# Altium project 2m_DBoard_RX.PrjPcb (part 1 of 2)
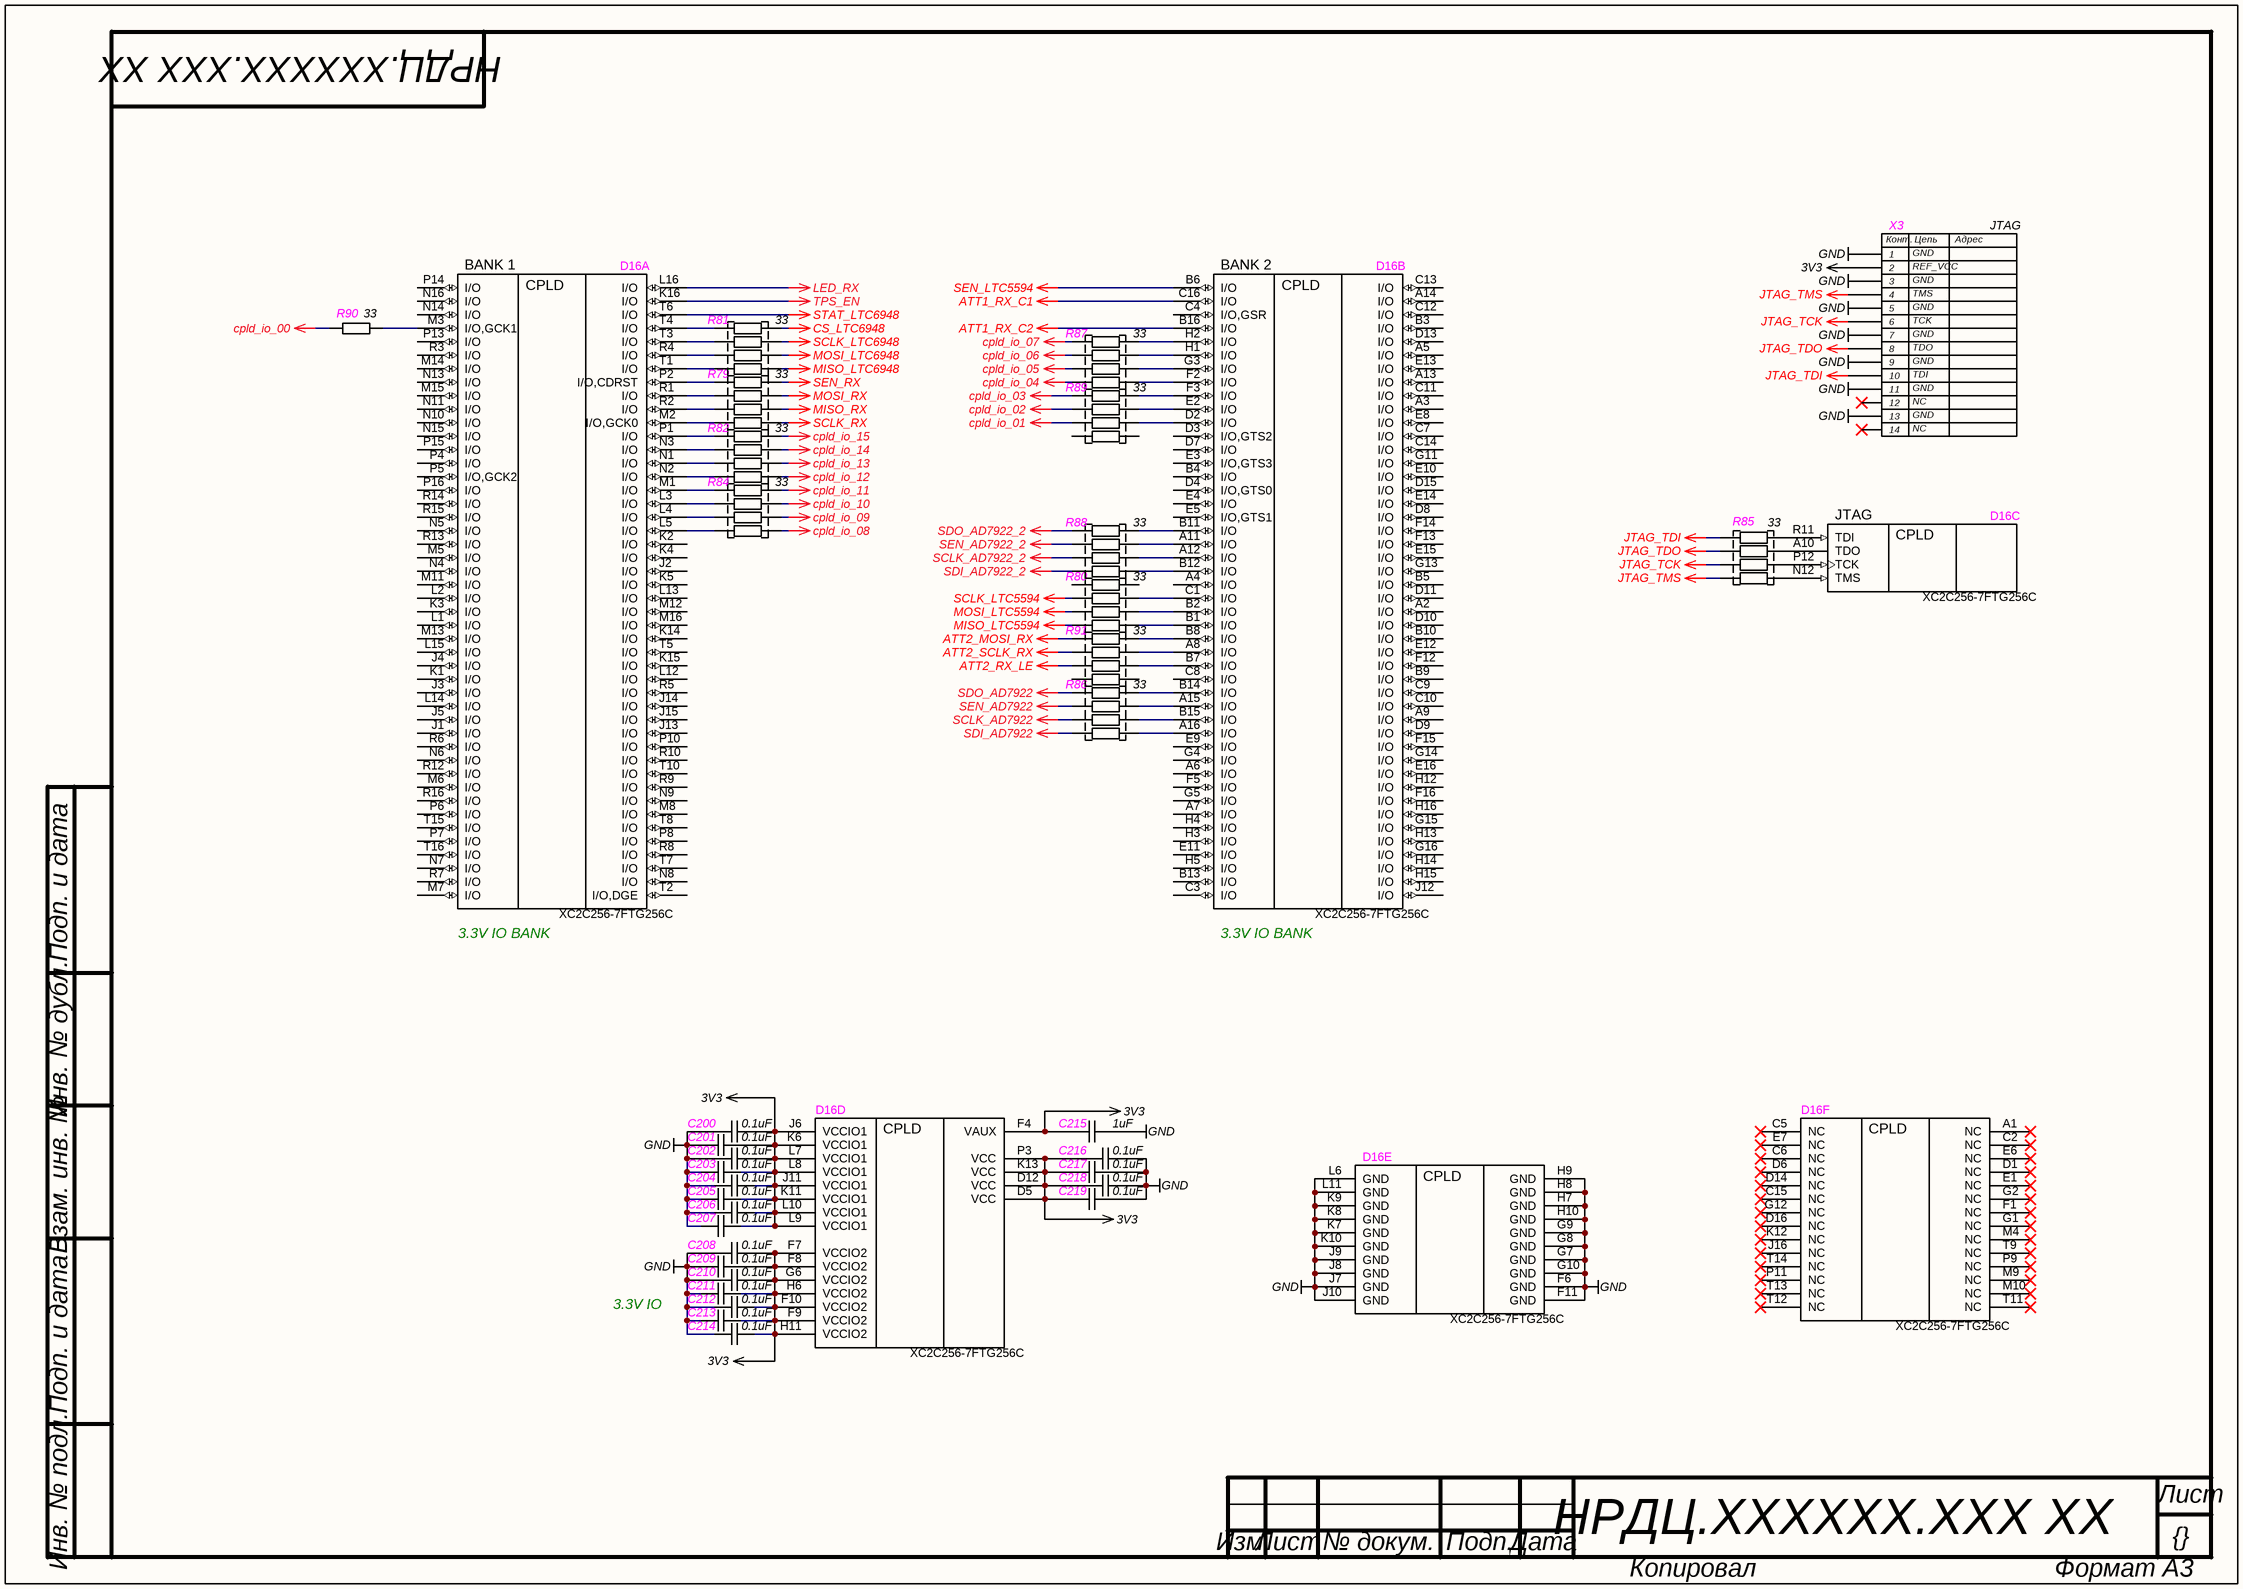
[diagram p0: CPLD.SchDoc]
5 sheets, 234 parts. Net scope: global (net labels, ports and power ports of the same name join across sheets).
Board file: 2m_DBoard_RX.PcbDoc
Sheets:
  CPLD.SchDoc
  RX.SchDoc
  Power.SchDoc
  IF_RX.SchDoc
  DBoard_conn.SchDoc

## Sheet CPLD.SchDoc: {Наименование}
size 420 x 297 mm; DocumentNumber: НРДЦ.ХХХХХХ.ХХХ ХХ; SheetNumber: {}; SheetTotal: {}; PageSetup: Record=PageOptions|CenterHorizontal=False|CenterVertical=False|PrintScale=0.95|XCorrection=0.00|YCorrection=0.00|PrintKind=1|BorderSize=5000000|LeftOffset=0|BottomOffset=0|Orientation=1|PaperLength=1000|PaperWidth=1000|Scale=100|PaperSource=15|PrintQuality=600|MediaType=1|DitherType=10|PaperKind=A4|PrintScaleMode=1; Rule: PcbType=ProtelPcb

### Parts
C200  value 0.1uF  [C0402]  (hidden comment: CAP)
C201  value 0.1uF  [C0402]  (hidden comment: CAP)
C202  value 0.1uF  [C0402]  (hidden comment: CAP)
C203  value 0.1uF  [C0402]  (hidden comment: CAP)
C204  value 0.1uF  [C0402]  (hidden comment: CAP)
C205  value 0.1uF  [C0402]  (hidden comment: CAP)
C206  value 0.1uF  [C0402]  (hidden comment: CAP)
C207  value 0.1uF  [C0402]  (hidden comment: CAP)
C208  value 0.1uF  [C0402]  (hidden comment: CAP)
C209  value 0.1uF  [C0402]  (hidden comment: CAP)
C210  value 0.1uF  [C0402]  (hidden comment: CAP)
C211  value 0.1uF  [C0402]  (hidden comment: CAP)
C212  value 0.1uF  [C0402]  (hidden comment: CAP)
C213  value 0.1uF  [C0402]  (hidden comment: CAP)
C214  value 0.1uF  [C0402]  (hidden comment: CAP)
C215  value 1uF  [C0402]  (hidden comment: CAP)
C216  value 0.1uF  [C0402]  (hidden comment: CAP)
C217  value 0.1uF  [C0402]  (hidden comment: CAP)
C218  value 0.1uF  [C0402]  (hidden comment: CAP)
C219  value 0.1uF  [C0402]  (hidden comment: CAP)
D16  XC2C256-7FTG256C  [FTG256]  (parts A,B,C,D,E,F of 6)
R79  value 33  [EXN8V]  (hidden comment: RES 4x0402)
R80  value 33  [EXN8V]  (hidden comment: RES 4x0402)
R81  value 33  [EXN8V]  (hidden comment: RES 4x0402)
R82  value 33  [EXN8V]  (hidden comment: RES 4x0402)
R84  value 33  [EXN8V]  (hidden comment: RES 4x0402)
R85  value 33  [EXN8V]  (hidden comment: RES 4x0402)
R86  value 33  [EXN8V]  (hidden comment: RES 4x0402)
R87  value 33  [EXN8V]  (hidden comment: RES 4x0402)
R88  value 33  [EXN8V]  (hidden comment: RES 4x0402)
R89  value 33  [EXN8V]  (hidden comment: RES 4x0402)
R90  value 33  [R0402]  (hidden comment: RES)
R91  value 33  [EXN8V]  (hidden comment: RES 4x0402)
X3  JTAG  [JTAG Mail 2mm]

### Nets
3V3: C200.2 C201.2 C202.2 C203.2 C204.2 C205.2 C206.2 C207.2 C208.2 C209.2 C210.2 C211.2 C212.2 C213.2 C214.2 C215.1 C216.1 C217.1 C218.1 C219.1 D16.D5(VCC) D16.D12(VCC) D16.F4(VAUX) D16.F7(VCCIO2) D16.F8(VCCIO2) D16.F9(VCCIO2) D16.F10(VCCIO2) D16.G6(VCCIO2) D16.H6(VCCIO2) D16.H11(VCCIO2) D16.J6(VCCIO1) D16.J11(VCCIO1) D16.K6(VCCIO1) D16.K11(VCCIO1) D16.K13(VCC) D16.L7(VCCIO1) D16.L8(VCCIO1) D16.L9(VCCIO1) D16.L10(VCCIO1) D16.P3(VCC) X3.2
ATT1_RX_C1: D16.C16(I/O)
ATT1_RX_C2: D16.B16(I/O)
ATT2_MOSI_RX: R91.5
ATT2_RX_LE: R91.7
ATT2_SCLK_RX: R91.6
cpld_io_00: R90.2
cpld_io_01: R89.6
cpld_io_02: R89.7
cpld_io_03: R89.8
cpld_io_04: R87.5
cpld_io_05: R87.6
cpld_io_06: R87.7
cpld_io_07: R87.8
cpld_io_08: R84.5
cpld_io_09: R84.6
cpld_io_10: R84.7
cpld_io_11: R84.8
cpld_io_12: R82.5
cpld_io_13: R82.6
cpld_io_14: R82.7
cpld_io_15: R82.8
CS_LTC6948: R81.8
GND: C200.1 C201.1 C202.1 C203.1 C204.1 C205.1 C206.1 C207.1 C208.1 C209.1 C210.1 C211.1 C212.1 C213.1 C214.1 C215.2 C216.2 C217.2 C218.2 C219.2 D16.F6(GND) D16.F11(GND) D16.G7(GND) D16.G8(GND) D16.G9(GND) D16.G10(GND) D16.H7(GND) D16.H8(GND) D16.H9(GND) D16.H10(GND) D16.J7(GND) D16.J8(GND) D16.J9(GND) D16.J10(GND) D16.K7(GND) D16.K8(GND) D16.K9(GND) D16.K10(GND) D16.L6(GND) D16.L11(GND) X3.1 X3.3 X3.5 X3.7 X3.9 X3.11 X3.13
JTAG_TCK: R85.6 X3.6
JTAG_TDI: R85.8 X3.10
JTAG_TDO: R85.7 X3.8
JTAG_TMS: R85.5 X3.4
LED_RX: D16.L16(I/O)
MISO_LTC5594: R80.5
MISO_LTC6948: R81.5
MISO_RX: R79.7
MOSI_LTC5594: R80.6
MOSI_LTC6948: R81.6
MOSI_RX: R79.6
SCLK_AD7922: R86.2
SCLK_AD7922_2: R88.6
SCLK_LTC5594: R80.7
SCLK_LTC6948: R81.7
SCLK_RX: R79.8
SDI_AD7922: R86.1
SDI_AD7922_2: R88.5
SDO_AD7922: R86.4
SDO_AD7922_2: R88.8
SEN_AD7922: R86.3
SEN_AD7922_2: R88.7
SEN_LTC5594: D16.B6(I/O)
SEN_RX: R79.5
STAT_LTC6948: D16.T6(I/O)
TPS_EN: D16.K16(I/O)
NetD16_A8: D16.A8(I/O) R91.3
NetD16_A10: D16.A10(TDO) R85.2
NetD16_A11: D16.A11(I/O) R88.1
NetD16_A12: D16.A12(I/O) R88.3
NetD16_A15: D16.A15(I/O) R86.6
NetD16_A16: D16.A16(I/O) R86.8
NetD16_B1: D16.B1(I/O) R80.4
NetD16_B2: D16.B2(I/O) R80.3
NetD16_B7: D16.B7(I/O) R91.2
NetD16_B8: D16.B8(I/O) R91.4
NetD16_B11: D16.B11(I/O) R88.2
NetD16_B12: D16.B12(I/O) R88.4
NetD16_B14: D16.B14(I/O) R86.5
NetD16_B15: D16.B15(I/O) R86.7
NetD16_C1: D16.C1(I/O) R80.2
NetD16_D2: D16.D2(I/O) R89.3
NetD16_E2: D16.E2(I/O) R89.2
NetD16_F2: D16.F2(I/O) R87.4
NetD16_F3: D16.F3(I/O) R89.1
NetD16_G3: D16.G3(I/O) R87.3
NetD16_H1: D16.H1(I/O) R87.2
NetD16_H2: D16.H2(I/O) R87.1
NetD16_L3: D16.L3(I/O) R84.2
NetD16_L4: D16.L4(I/O) R84.3
NetD16_L5: D16.L5(I/O) R84.4
NetD16_M1: D16.M1(I/O) R84.1
NetD16_M2: D16.M2(I/O,GCK0) R79.1
NetD16_M3: D16.M3(I/O,GCK1) R90.1
NetD16_N1: D16.N1(I/O) R82.3
NetD16_N2: D16.N2(I/O) R82.4
NetD16_N3: D16.N3(I/O) R82.2
NetD16_N12: D16.N12(TMS) R85.4
NetD16_P1: D16.P1(I/O) R82.1
NetD16_P2: D16.P2(I/O,CDRST) R79.4
NetD16_P12: D16.P12(TCK) R85.3
NetD16_R1: D16.R1(I/O) R79.3
NetD16_R2: D16.R2(I/O) R79.2
NetD16_R4: D16.R4(I/O) R81.2
NetD16_R11: D16.R11(TDI) R85.1
NetD16_T1: D16.T1(I/O) R81.4
NetD16_T3: D16.T3(I/O) R81.3
NetD16_T4: D16.T4(I/O) R81.1

Not connected (* = marked no-connect by the designer): D16 A1(NC)* A2(I/O) A3(I/O) A4(I/O) A5(I/O) A6(I/O) A7(I/O) A9(I/O) A13(I/O) A14(I/O) B3(I/O) B4(I/O) B5(I/O) B9(I/O) B10(I/O) B13(I/O) C2(NC)* C3(I/O) C4(I/O,GSR) C5(NC)* C6(NC)* C7(I/O) C8(I/O) C9(I/O) C10(I/O) C11(I/O) C12(I/O) C13(I/O) C14(I/O) C15(NC)* D1(NC)* D3(I/O,GTS2) D4(I/O,GTS0) D6(NC)* D7(I/O) D8(I/O) D9(I/O) D10(I/O) D11(I/O) D13(I/O) D14(NC)* D15(I/O) D16(NC)* E1(NC)* E3(I/O,GTS3) E4(I/O) E5(I/O,GTS1) E6(NC)* E7(NC)* E8(I/O) E9(I/O) E10(I/O) E11(I/O) E12(I/O) E13(I/O) E14(I/O) E15(I/O) E16(I/O) F1(NC)* F5(I/O) F12(I/O) F13(I/O) F14(I/O) F15(I/O) F16(I/O) G1(NC)* G2(NC)* G4(I/O) G5(I/O) G11(I/O) G12(NC)* G13(I/O) G14(I/O) G15(I/O) G16(I/O) H3(I/O) H4(I/O) H5(I/O) H12(I/O) H13(I/O) H14(I/O) H15(I/O) H16(I/O) J1(I/O) J2(I/O) J3(I/O) J4(I/O) J5(I/O) J12(I/O) J13(I/O) J14(I/O) J15(I/O) J16(NC)* K1(I/O) K2(I/O) K3(I/O) K4(I/O) K5(I/O) K12(NC)* K14(I/O) K15(I/O) L1(I/O) L2(I/O) L12(I/O) L13(I/O) L14(I/O) L15(I/O) M4(NC)* M5(I/O) M6(I/O) M7(I/O) M8(I/O) M9(NC)* M10(NC)* M11(I/O) M12(I/O) M13(I/O) M14(I/O) M15(I/O) M16(I/O) N4(I/O) N5(I/O) N6(I/O) N7(I/O) N8(I/O) N9(I/O) N10(I/O) N11(I/O) N13(I/O) N14(I/O) N15(I/O) N16(I/O) P4(I/O) P5(I/O,GCK2) P6(I/O) P7(I/O) P8(I/O) P9(NC)* P10(I/O) P11(NC)* P13(I/O) P14(I/O) P15(I/O) P16(I/O) R3(I/O) R5(I/O) R6(I/O) R7(I/O) R8(I/O) R9(I/O) R10(I/O) R12(I/O) R13(I/O) R14(I/O) R15(I/O) R16(I/O) T2(I/O,DGE) T5(I/O) T7(I/O) T8(I/O) T9(NC)* T10(I/O) T11(NC)* T12(NC)* T13(NC)* T14(NC)* T15(I/O) T16(I/O); R80 1 8; R89 4 5; R91 1 8; X3 12* 14*

### Notes on the sheet
- (near X3) GND
- (near X3) REF_VCC
- (near X3) TMS
- (near X3) TCK
- (near X3) TDO
- (near X3) TDI
- (near X3) NC
- (near D16) 3.3V IO BANK
- 3.3V IO
- Подп. и дата
- Инв. № дубл.
- Взам. инв. №
- Инв. № подл.
- Лист
- Изм.
- № докум.
- Подп.
- Дата
- Копировал
- Формат А3
- (in symbol HDR Debug_14-pin) Конт.; Цепь; Адрес
- (in symbol XC2C256-7FTG256C, part A) BANK 1
- (in symbol XC2C256-7FTG256C, part B) BANK 2
- (in symbol XC2C256-7FTG256C, part C) JTAG

### Library data of the parts
C200-C214 C216-C219 = CAP: SMD Capacitor; Manufacturer: Murata; Material: X7R; Tolerance: 10%; Voltage: 10V; Type: Ceramic Capacitor; P/N: GRM155R71A104KA01J; Supplier 1: Digi-key; Supplier Part Number 1: 490-6322-1-ND; Supplier 2: Mouser; Supplier Part Number 2: 81-GRM155R71A104KA1J; Supplier 3: Farnell; Supplier Part Number 3: *
C215 = CAP: SMD Capacitor; Manufacturer: Murata; Material: X7R; Tolerance: 10%; Voltage: 6.3V; Type: Ceramic Capacitor; P/N: GRM155R70J105KA12J; Supplier 1: Digi-key; Supplier Part Number 1: 490-13339-1-ND; Supplier 2: Mouser; Supplier Part Number 2: 81-GRM155R70J105KA2J; Supplier 3: Farnell; Supplier Part Number 3: *
D16 = XC2C256-7FTG256C: CoolRunner-II 1.8V, 256 Macrocell CPLD, 184 User I/Os, 256-Ball FTBGA, Commercial Grade, Pb-Free; Code_JEDEC: MS-034-AAF-1*; PackageVersion: ver1.3, Oct-2007; PackageReference: FTG256; PackageDescription: 256-Ball Fine Pitch Thin Ball Grid Array 1.00 mm Pitch (FTG256) - Pb-Free; DatasheetVersion: ver3.2, Mar-2007; PartNumber: XC2C256-7FTG256C; P/N: XC2C256-7FTG256C; Name: XC2C256-7FTG256C; Type: CPLD; Supplier 1: Digi-key; Supplier Part Number 1: 122-1400-ND; Supplier 2: Mouser; Supplier Part Number 2: 217-XC2C256-7FTG256C; Supplier 3: Farnell; Supplier Part Number 3: *
R79-R82 R84-R89 R91 = RES 4x0402: Chip Resistor Array; Manufacturer: Panasonic; Name: EXBN8V; Number of Resistors: 4; Tolerance: 5%; P/N: EXB-N8V330JX; Type: 0402 Array Concave Terminal; Number of Terminals: 8; Series: EXB; Supplier Part Number 1: Y10330CT-ND; Supplier 2: Mouser; Supplier Part Number 2: 667-EXB-N8V330JX; Supplier 3: Farnell; Supplier Part Number 3: *
  R79 R80 R82 R84-R89 R91: Supplier 1: Digi-key
  R81: Supplier 1: Digi-Key
R90 = RES: SMD Resistor; Name: Chip SMD Resistor; Power: 0.1 Wt; Tolerance: 1%; P/N: ERJ-2RKF33R0X; Temperature Range: -55…155°C; Supplier 1: Digi-key; Supplier Part Number 1: P33.0LCT-ND; Supplier 2: Mouser; Supplier Part Number 2: 667-ERJ-2RKF33R0X; Supplier 3: Farnell; Supplier Part Number 3: *
X3 = HDR Debug_14-pin: 2.00mm Pitch, Milli-Grid PCB Header, Dual Row, Vertical, Through Hole, Shrouded, 14 / Circuits; Manufacturer: Molex; Name: Milli-Grid Connector System; P/N: 878311421; Type: 2.00mm Pitch, Milli-Grid PCB Header, Dual Row, Vertical, Through Hole, Shrouded, 14; Series: 87831; Supplier 1: Digi-key; Supplier Part Number 1: WM4224-ND; Supplier 2: Mouser; Supplier Part Number 2: 538-87831-1421; Supplier 3: Farnell; Supplier Part Number 3: *

## Sheet RX.SchDoc: {Наименование}
size 420 x 297 mm; ApprovedBy: {Утвердил}; CheckedBy: {Проверил}; DrawnBy: {Разраб.}; DocumentNumber: НРДЦ.ХХХХХХ.ХХХ 00; SheetNumber: {}; SheetTotal: {}; Scale: {Мш.}; PageSetup: Record=PageOptions|CenterHorizontal=False|CenterVertical=False|PrintScale=0.95|XCorrection=0.00|YCorrection=0.00|PrintKind=1|BorderSize=5000000|LeftOffset=0|BottomOffset=0|Orientation=1|PaperLength=1000|PaperWidth=1000|Scale=100|PaperSource=15|PrintQuality=600|MediaType=1|DitherType=10|PaperKind=A4|PrintScaleMode=1; ProcessInspection: {Т.контр.}; Mass: {М.}; NormInspection: {Н.контр.}; Letter1Column: {}; Letter2Column: {}; Letter3Column: {}; DocumentType: {Документ}; Rule: PcbType=ProtelPcb
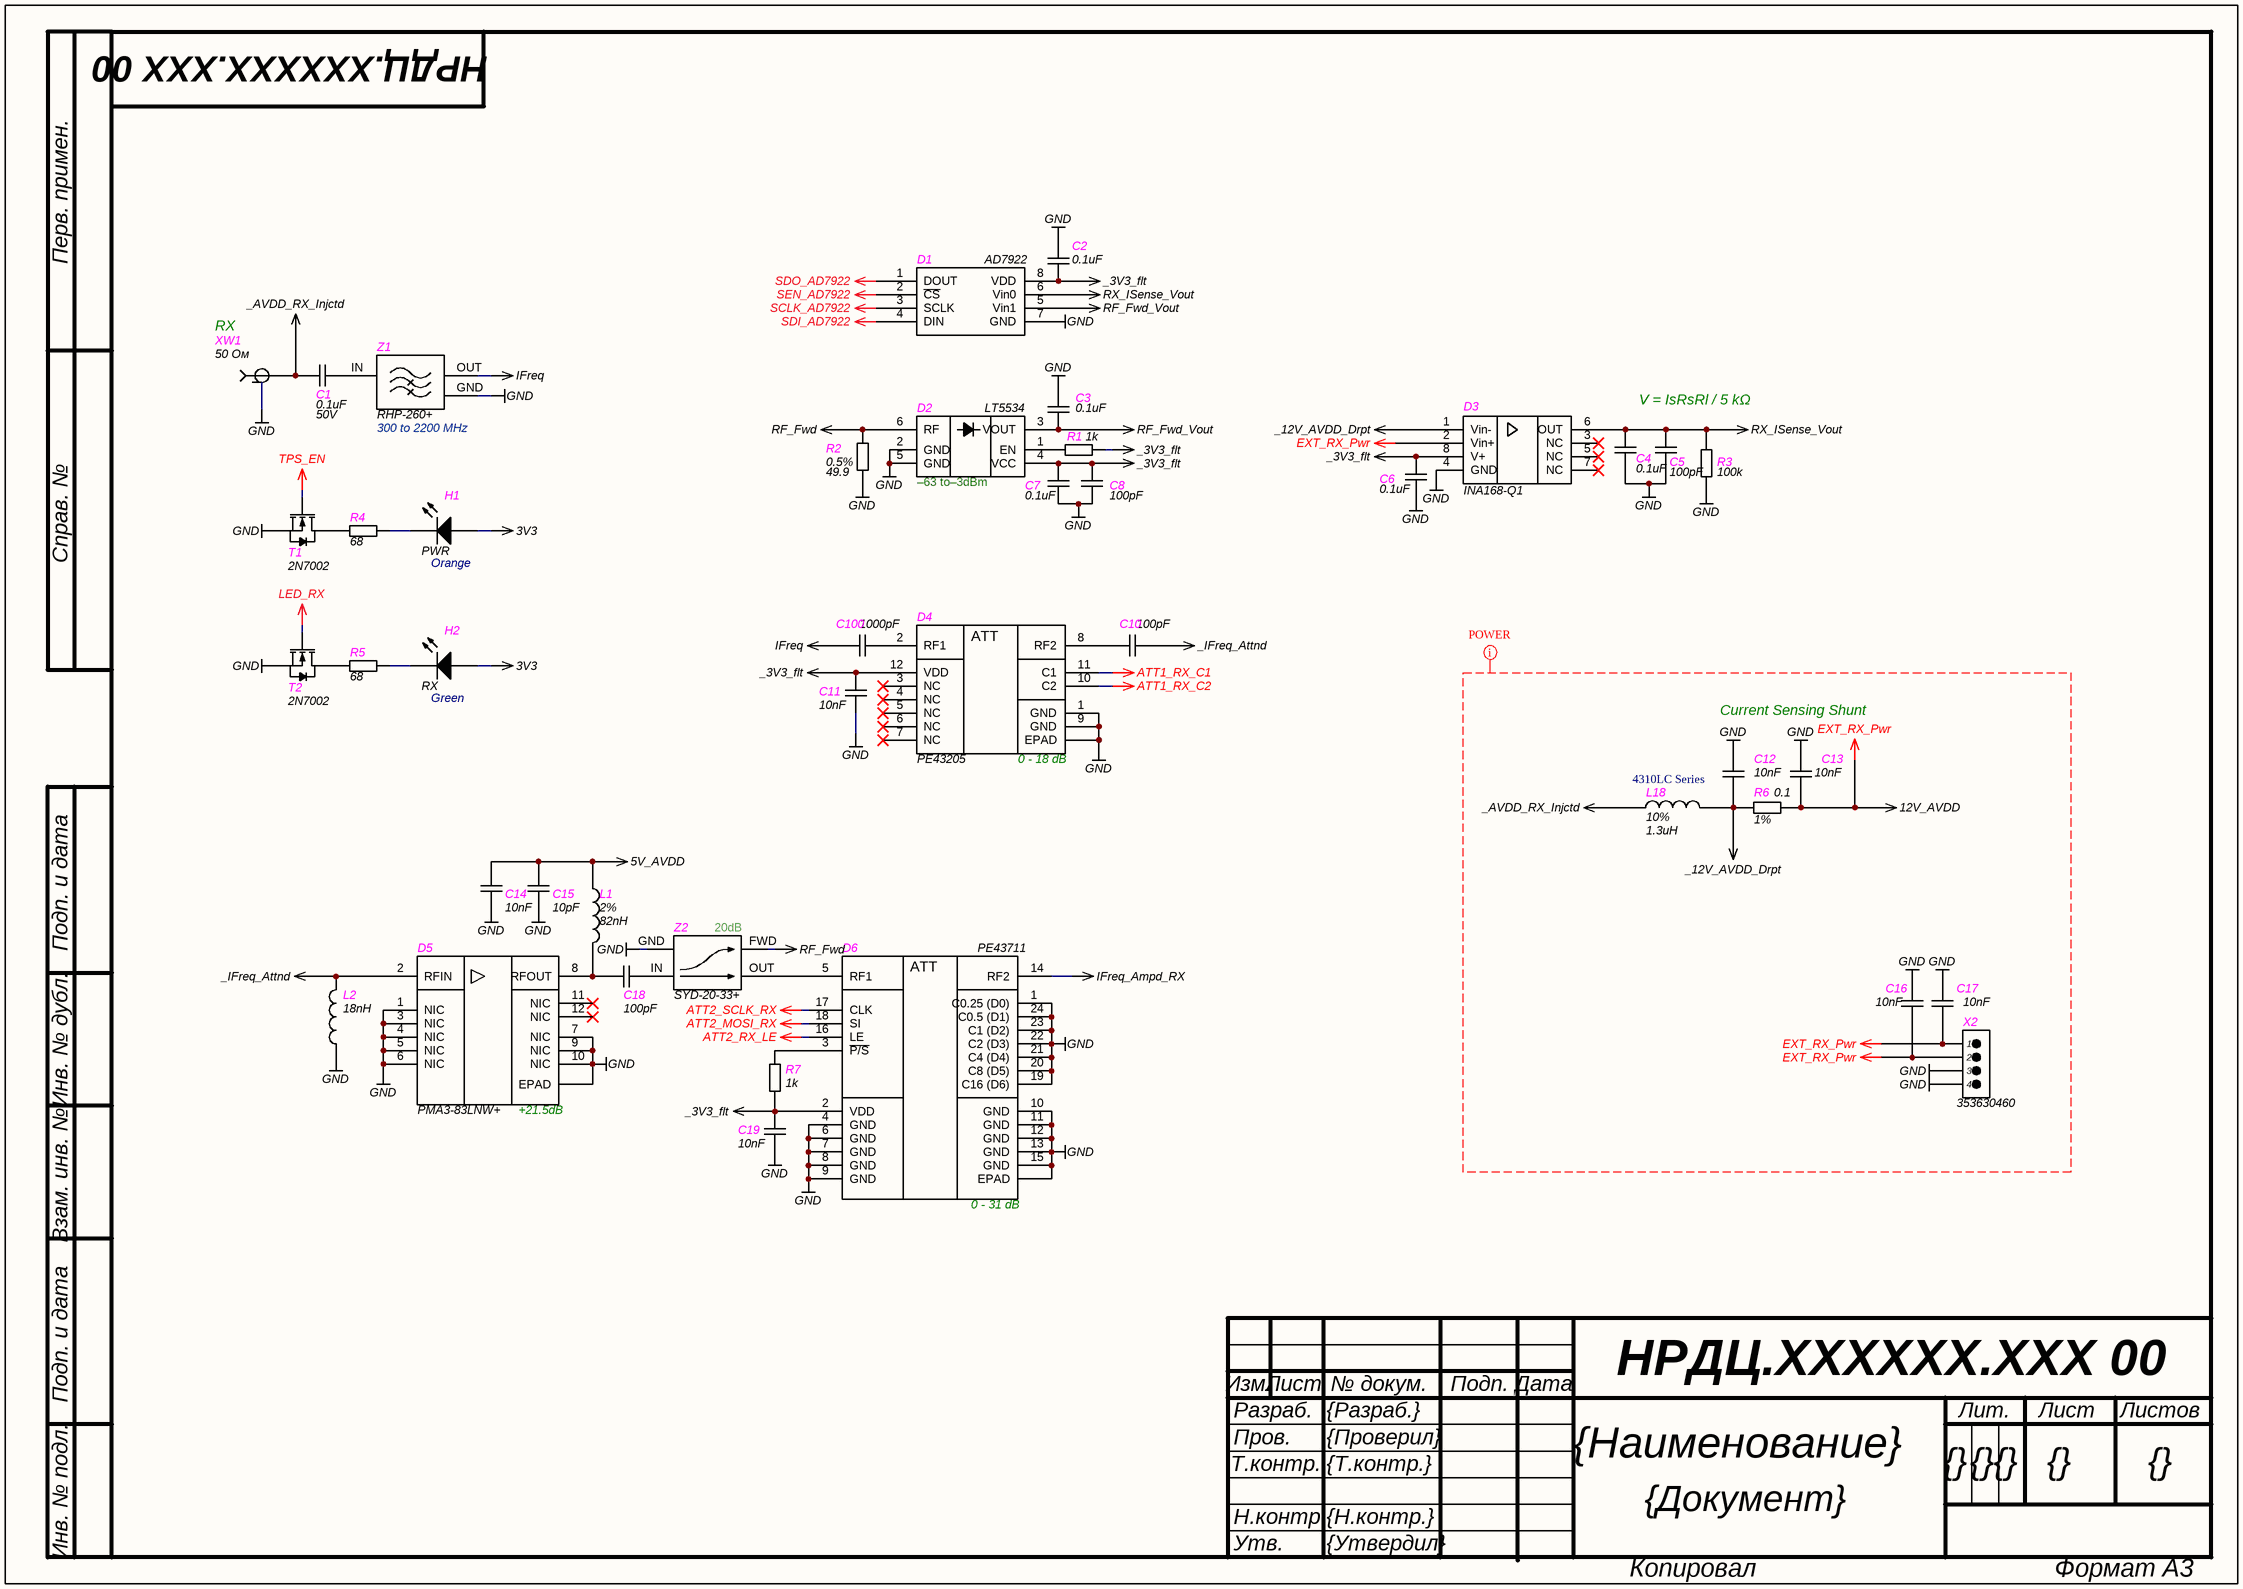
[diagram p1: RX.SchDoc]

### Parts
C1  value 0.1uF  Voltage: 50V  [C1206]  (hidden comment: CAP)
C2  value 0.1uF  [C0402]  (hidden comment: CAP)
C3  value 0.1uF  [C0402]  (hidden comment: CAP)
C4  value 0.1uF  [C0402]  (hidden comment: CAP)
C5  value 100pF  [C0402]  (hidden comment: CAP)
C6  value 0.1uF  [C0402]  (hidden comment: CAP)
C7  value 0.1uF  [C0402]  (hidden comment: CAP)
C8  value 100pF  [C0402]  (hidden comment: CAP)
C10  value 100pF  [C0402]  (hidden comment: CAP)
C11  value 10nF  [C0402]  (hidden comment: CAP)
C12  value 10nF  [C0402]  (hidden comment: CAP)
C13  value 10nF  [C0402]  (hidden comment: CAP)
C14  value 10nF  [C0402]  (hidden comment: CAP)
C15  value 10pF  [C0402]  (hidden comment: CAP)
C16  value 10nF  [C0402]  (hidden comment: CAP)
C17  value 10nF  [C0402]  (hidden comment: CAP)
C18  value 100pF  [C0402]  (hidden comment: CAP)
C19  value 10nF  [C0402]  (hidden comment: CAP)
C100  value 1000pF  [C0402]  (hidden comment: CAP)
D1  AD7922  [MSOP-8]
D2  LT5534  RF Input Power Range: –63 to–3dBm  [SC70]
D3  INA168-Q1  [TSSOP (8)]
D4  PE43205  [QFN-12]
D5  PMA3-83LNW+  [DQ1225]
D6  PE43711  [QFN-24]
H1  PWR  Color: Orange  [LED_0805_Green]
H2  RX  Color: Green  [LED_0805_Green]
L1  value 82nH  Tolerance: 2%  [L0603_HP]  (hidden comment: Inductor RF)
L2  value 18nH  [L0603_HP]  (hidden comment: Inductor RF)
L18  value 1.3uH  Tolerance: 10%  [4310LC]  (hidden comment: Inductor RF)
R1  value 1k  [R0402]  (hidden comment: RES)
R2  value 49.9  Tolerance: 0.5%  [R0402]  (hidden comment: RES)
R3  value 100k  [R0402]  (hidden comment: RES)
R4  value 68  [R0402]  (hidden comment: RES)
R5  value 68  [R0402]  (hidden comment: RES)
R6  value 0.1  Tolerance: 1%  [R0805]  (hidden comment: RES)
R7  value 1k  [R0402]  (hidden comment: RES)
T1  2N7002  [SOT-23]
T2  2N7002  [SOT-23]
X2  353630460  [CON_353630460]
XW1  50 Ом  [MOLEX SD-73251-135 (Gold)]
Z1  RHP-260+  Frequency: 300 to 2200 MHz  [GP731]
Z2  SYD-20-33+  Coupling: 20dB  [AH202]

### Nets
3V3: H1.2(A) H2.2(A)
5V_AVDD: C14.2 C15.2 L1.2
12V_AVDD: C13.1 C16.2 C17.2 D3.2(Vin+) R6.1 X2.1 X2.2  [also labelled EXT_RX_Pwr]
_3V3_flt: C2.1 C6.2 C7.2 C8.2 C11.2 C19.2 D1.8(VDD) D2.4(VCC) D3.8(V+) D4.12(VDD) D6.2(VDD) R1.1 R7.1
_12V_AVDD_Drpt: C12.1 D3.1(Vin-) L18.1 R6.2
_AVDD_RX_Injctd: C1.1 L18.2 XW1.S(RF)
_IFreq_Attnd: C10.2 D5.2(RFIN) L2.2
ATT1_RX_C1: D4.11(C1)
ATT1_RX_C2: D4.10(C2)
ATT2_MOSI_RX: D6.18(SI)
ATT2_RX_LE: D6.16(LE)
ATT2_SCLK_RX: D6.17(CLK)
GND: C2.2 C3.1 C4.1 C5.1 C6.1 C7.1 C8.1 C11.1 C12.2 C13.2 C14.1 C15.1 C16.1 C17.1 C19.1 D1.7(GND) D2.2(GND) D2.5(GND) D3.4(GND) D4.1(GND) D4.9(GND) D4.13(EPAD) D5.1(NIC) D5.3(NIC) D5.4(NIC) D5.5(NIC) D5.6(NIC) D5.7(NIC) D5.9(NIC) D5.10(NIC) D5.13(EPAD) D6.1(C0.25_(D0)) D6.4(GND) D6.6(GND) D6.7(GND) D6.8(GND) D6.9(GND) D6.10(GND) D6.11(GND) D6.12(GND) D6.13(GND) D6.15(GND) D6.19(C16_(D6)) D6.20(C8_(D5)) D6.21(C4_(D4)) D6.22(C2_(D3)) D6.23(C1_(D2)) D6.24(C0.5_(D1)) D6.25(EPAD) L2.1 R2.2 R3.1 T1.2(S) T2.2(S) X2.3 X2.4 XW1.G(GND) Z1.GND Z2.GND
IFreq: C100.1 Z1.OUT
IFreq_Ampd_RX: D6.14(RF2)
LED_RX: T2.1(G)
RF_Fwd: D2.6(RF) R2.1 Z2.FWD
RF_Fwd_Vout: C3.2 D1.5(Vin1) D2.3(VOUT)
RX_ISense_Vout: C4.2 C5.2 D1.6(Vin0) D3.6(OUT) R3.2
SCLK_AD7922: D1.3(SCLK)
SDI_AD7922: D1.4(DIN)
SDO_AD7922: D1.1(DOUT)
SEN_AD7922: D1.2(~{CS})
TPS_EN: T1.1(G)
NetC1_2: C1.2 Z1.IN
NetC10_1: C10.1 D4.8(RF2)
NetC18_1: C18.1 D5.8(RFOUT) L1.1
NetC18_2: C18.2 Z2.IN
NetC100_2: C100.2 D4.2(RF1)
NetD2_1: D2.1(EN) R1.2
NetD6_3: D6.3(~{P/S}) R7.2
NetD6_5: D6.5(RF1) Z2.OUT
NetH1_1: H1.1(K) R4.2
NetH2_1: H2.1(K) R5.1
NetR4_1: R4.1 T1.3(D)
NetR5_2: R5.2 T2.3(D)

Not connected (* = marked no-connect by the designer): D3 3(NC)* 5(NC)* 7(NC)*; D4 3(NC)* 4(NC)* 5(NC)* 6(NC)* 7(NC)*; D5 11(NIC)* 12(NIC)*

### Layout directives
net class POWER: 12V_AVDD, _12V_AVDD_Drpt, _AVDD_RX_Injctd, EXT_RX_Pwr, GND

### Notes on the sheet
- (near XW1) RX
- V = IsRsRl / 5 kΩ
- Current Sensing Shunt
- 4310LC Series
- Перв. примен.
- Справ. №
- Подп. и дата
- Инв. № дубл.
- Взам. инв. №
- Изм.
- Лист
- № докум.
- Подп.
- Дата
- Т.контр.
- Пров.
- Разраб.
- Лит.
- Листов
- Инв. № подл.
- Н.контр.
- Утв.
- Копировал
- Формат А3
- (in symbol PE43205) ATT; 0 - 18 dB
- (in symbol PE43711) ATT; 0 - 31 dB
- (in symbol PMA3-83LNW+) +21.5dB

### Library data of the parts
C1 = CAP: SMD Capacitor; Manufacturer: Murata; Material: NP0; Tolerance: 5%; Type: Ceramic Capacitor; P/N: GRM31C5C1H104JA01K; Supplier 1: Digi-Key; Supplier Part Number 1: 490-8335-1-ND; Supplier 2: Mouser; Supplier Part Number 2: 81-GRM31C5C1H104JA1K; Supplier 3: Farnell; Supplier Part Number 3: *
C2-C4 C6 C7 = CAP: as C200 on sheet CPLD; Supplier 1: Digi-key; Supplier Part Number 1: 490-6322-1-ND; Supplier 2: Mouser; Supplier Part Number 2: 81-GRM155R71A104KA1J; Supplier 3: Farnell; Supplier Part Number 3: *
C5 C8 C10 C18 = CAP: SMD Capacitor; Manufacturer: Murata; Material: NP0; Tolerance: 1%; Voltage: 50V; Type: Ceramic Capacitor; P/N: GRM1555C1H101FA01D; Supplier 1: Digi-key; Supplier Part Number 1: 490-8180-1-ND; Supplier 2: Mouser; Supplier Part Number 2: 81-GRM1555C1H101FA1D; Supplier 3: Farnell; Supplier Part Number 3: *
C11-C14 C16 C17 C19 = CAP: SMD Capacitor; Manufacturer: Murata; Material: X7R; Tolerance: 10%; Voltage: 25V; Type: Ceramic Capacitor; P/N: GRM155R71E103KA01D; Supplier 1: Digi-key; Supplier Part Number 1: 490-1312-1-ND; Supplier 2: Mouser; Supplier Part Number 2: 81-GRM36X103K25; Supplier 3: Farnell; Supplier Part Number 3: *
C15 = CAP: SMD Capacitor; Manufacturer: Murata; Material: NP0; Tolerance: 1%; Voltage: 50V; Type: Ceramic Capacitor; P/N: GRM1555C1H100FA01D; Supplier 1: Digi-key; Supplier Part Number 1: 490-6186-1-ND; Supplier 2: Mouser; Supplier Part Number 2: 81-GRM1555C1H100FA1D; Supplier 3: Farnell; Supplier Part Number 3: *
C100 = CAP: SMD Capacitor; Manufacturer: Murata; Material: NP0; Tolerance: 5%; Voltage: 50V; Type: Ceramic Capacitor; P/N: GRM1555C1H102JA01D; Supplier 1: Digi-key; Supplier Part Number 1: 490-3244-1-ND; Supplier 2: Mouser; Supplier Part Number 2: 81-GRM1555C1H102JA1D; Supplier 3: Farnell; Supplier Part Number 3: *
D1 = AD79x2: 1 MSPS, 10-/12-Bit ADC; Manufacturer: Analog Device; Fast throughput rate: 1MHz; High speed serial interface: SPI®/QSPI™/MICROWIRE™/DSP compatible; Name: AD7922ARM; Type: 2-Channel, 2.35 V to 5.25 V,1 MSPS, 10-/12-Bit ADC; Voltage: 2.35 V to 5.25 V; P/N: AD7922ARMZ; Package: MSOP-8; Value: AD7922; Supplier 1: Digi-key; Supplier Part Number 1: 505-AD7922ARMZ-ND; Supplier 2: Mouser; Supplier Part Number 2: 584-AD7922ARMZ; Supplier 3: Farnell; Supplier Part Number 3: *
D2 = LT5534: 50MHz to 3GHz monolithic RF power / detector; Manufacturer: Linear Technology; Voltage: Single 2.7V to 5.25V; Impedance: 2kΩ; Frequency Range: 50 to 3000 MHz; Name: LT5534; Package: 6-Lead SC70; Type: RF Power Detector; P/N: LT5534; Supplier 1: Digi-Key; Supplier Part Number 1: LT5534ESC6#TRMPBFCT-ND; Value: LT5534; Supplier 2: Mouser; Supplier Part Number 2: 584-LT5534ESC6TRMPBF; Supplier 3: Farnell; Supplier Part Number 3: 4029917RL
D3 = INA168-Q1: Automotive-Grade, High-Side, Current-Output, Current-Shunt Monitor; Manufacturer: Texas Instruments; Name: INA168Q; Voltage: 2.7 V to 60 V; P/N: INA168QPWRQ1; Voltage Gain: Adjustable; Frequency Range: 800kHz; Package: TSSOP (8); Type: Current-Shunt Monitor; Supplier 1: Digi-Key; Supplier Part Number 1: 296-17201-1-ND; Value: INA168-Q1; Supplier 2: Mouser; Supplier Part Number 2: 595-INA168QPWRQ1; Supplier 3: Farnell; Supplier Part Number 3: *
D4 = PE43205: 50Ω, HaRP™ technology-enhanced / fast switching 2-bit RF Digital Step Attenuator; Manufacturer: Peregrine Technical Solutions; Type: 2-bit, 18 dB; Name: PE43205; P/N: PE43205; Package: Green 12-lead 3x3 mm QFN; Supplier 1: Digi-Key; Supplier Part Number 1: 1046-1114-6-ND; Value: PE43205; Supplier 2: Mouser; Supplier Part Number 2: 81-PE43205B-Z; Supplier 3: Farnell; Supplier Part Number 3: *
D5 = PMA3-83LNW+: PHEMT based wideband, low noise MMIC amplifier; Manufacturer: Mini-Circuits; Type: LNA; Frequency Range: 0.4 to 8.0 GHz; Impedance: 50Ω; Name: PMA3-83LNW+; Package: DQ1225; P/N: PMA3-83LNW+; Value: PMA3-83LNW+; Supplier 1: Digi-Key; Supplier Part Number 1: 3157-PMA3-83LNW+CT-ND; Supplier 2: Mouser; Supplier Part Number 2: 139-PMA3-83LNW; Supplier 3: Farnell; Supplier Part Number 3: *
D6 = PE43711: The PE43711 is a 50Ω, HaRP™ technology-enhanced, 7-bit RF digital step attenuator; Manufacturer: Peregrine Technical Solutions; P/N: PE43711B-Z; Type: 7-bit RF digital step attenuator (DSA); Name: PE43711; Package: 24-lead 4 × 4 × 0.85 mm QFN; Supplier 1: Digi-Key; Supplier Part Number 1: 1046-1138-1-ND; Value: PE43711; Supplier 2: Mouser; Supplier Part Number 2: 81-PE43711B-Z; Supplier 3: Farnell; Supplier Part Number 3: *
H1 = LED: CHIP LED LAMP; Manufacturer: Kingbright; Name: APHCM2012; P/N: APHCM2012SECK-F01; Package: 2.0 x 1.25 mm SMD; Type: CHIP LED LAMP; Supplier 1: Digi-key; Supplier Part Number 1: 754-1096-1-ND; Supplier 2: Mouser; Supplier Part Number 2: 604-APHCM2012SECK; Supplier 3: Farnell; Supplier Part Number 3: *
H2 = LED: CHIP LED LAMP; Manufacturer: Kingbright; Name: APHCM2012; P/N: APHCM2012CGCK-F01; Package: 2.0 x 1.25 mm SMD; Type: CHIP LED LAMP; Supplier 1: Digi-Key; Supplier Part Number 1: 754-1094-1-ND; Supplier 2: Mouser; Supplier Part Number 2: 604-APHCM2012CGCK; Supplier 3: Farnell; Supplier Part Number 3: *
L1 = Inductor RF: Chip SMD Inductor; Manufacturer: Coilcraft; Current: 510mA; Frequency: 1.8GHz; Name: 0603HP-82NXGL; Series: 0603HP; Temperature Range: -25…85°C; P/N: 0603HP-82NXGL; Supplier 1: Digi-key; Supplier Part Number 1: *; Supplier 2: Mouser; Supplier Part Number 2: 994-0603HP-82NXGLW; Supplier 3: Farnell; Supplier Part Number 3: 2286167
L2 = Inductor RF: Chip SMD Inductor; Manufacturer: Coilcraft; Current: 1200mA; Frequency: 3.30GHz; Name: 0603HP-18NXG; Tolerance: 2%; P/N: 0603HP-18NXGRW; Series: 0603HP; Temperature Range: -25…85°C; Supplier 1: Digi-key; Supplier Part Number 1: *; Supplier 2: Mouser; Supplier Part Number 2: 994-0603HP-18NXGRW; Supplier 3: Farnell; Supplier Part Number 3: 2286149
L18 = Inductor RF: Chip SMD Inductor; Manufacturer: Coilcraft; Current: 2.7A; Frequency: 235MHz; Name: 4310LC-132KE_; Series: 4310LC; Temperature Range: -40…85°C; P/N: 4310LC-132KE_; Supplier 1: Digi-key; Supplier Part Number 1: *; Supplier 2: Mouser; Supplier Part Number 2: 994-4310LC-132KEC; Supplier 3: Farnell; Supplier Part Number 3: *
R1 R7 = RES: SMD Resistor; Name: Chip SMD Resistor; Power: 0.062 Wt; Tolerance: 5%; P/N: ERJ-2GEJ102X; Temperature Range: -55…155°C; Supplier 1: Digi-key; Supplier Part Number 1: P1.0KJCT-ND; Supplier 2: Mouser; Supplier Part Number 2: 667-ERJ-2GEJ102X; Supplier 3: Farnell; Supplier Part Number 3: *
R2 = RES: SMD Resistor; Manufacturer: Panasonic Electronic Components; Name: Chip SMD Resistor; Power: 0.063 Wt; P/N: ERJ-2RKD49R9X; Temperature Range: -55…155°C; Supplier 1: Digi-key; Supplier Part Number 1: P15987CT-ND; Supplier 2: Mouser; Supplier Part Number 2: 667-ERJ-2RKD49R9X; Supplier 3: Farnell; Supplier Part Number 3: *
R3 = RES: SMD Resistor; Manufacturer: Panasonic Electronic Components; Name: Chip SMD Resistor; Power: 1/5 Wt; Tolerance: 1%; P/N: ERJ-PA2F1003X; Temperature Range: -55…155°C; Supplier 1: Digi-key; Supplier Part Number 1: P17236CT-ND; Supplier 2: Mouser; Supplier Part Number 2: 667-ERJ-PA2F1003X; Supplier 3: Farnell; Supplier Part Number 3: *
R4 R5 = RES: SMD Resistor; Name: Chip SMD Resistor; Power: 0.062 Wt; Tolerance: 5%; P/N: ERJ-2GEJ680X; Temperature Range: -55…155°C; Supplier 1: Digi-key; Supplier Part Number 1: P68JCT-ND; Supplier 2: Mouser; Supplier Part Number 2: 667-ERJ-2GEJ680X; Supplier 3: Farnell; Supplier Part Number 3: *
R6 = RES: SMD Resistor; Manufacturer: Panasonic Electronic Components; Name: Chip SMD Resistor; Power: 1/2 Wt; P/N: ERJ-6DSFR10V; Temperature Range: -55…155°C; Supplier 1: Digi-key; Supplier Part Number 1: P19308CT-ND; Supplier 2: Mouser; Supplier Part Number 2: 667-ERJ-6DSFR10V; Supplier 3: Farnell; Supplier Part Number 3: *
T1 T2 = 2N7002: N-Channel MOSFET 2N7002; Channel Resistance: 5Ohm; Current: 300mA; Power Dissipation: 0.83W; Voltage: 60V; P/N: 2N7002NXAKR; Name: 2N7002; Type: SOT-23; Package: SOT-23; Value: 2N7002; Supplier 1: Digi-key; Supplier Part Number 1: 1727-8643-1-ND; Supplier 2: Mouser; Supplier Part Number 2: 771-2N7002NXAKR; Supplier 3: Farnell; Supplier Part Number 3: *
X2 = 353630460: 2.00mm Pitch Sherlock Wire-to-Board Header, Right-Angle, with Positive Lock, 4 Circuits; Manufacturer: Molex; Mate-with P/N: 355070400; Mate-with Series: 35507; P/N: 353630460; Type: 2.00mm Pitch Sherlock Wire-to-Board Header, Right-Angle; Series: 35363; Pitch: 2.00mm; Name: 353630460; Supplier 1: Digi-Key; Supplier Part Number 1: WM18933-ND; Value: 353630460; Supplier 2: Mouser; Supplier Part Number 2: 538-35363-0460; Supplier 3: Farnell; Supplier Part Number 3: *
XW1 = RF Connector: 50 Ohms, SMA Jack, Vertica; Manufacturer: Molex; Impedance: 50Ω; P/N: 0732511352; Name: SMA Jack; Type: 50 Ohms, SMA Jack, Vertical, PCB SMT, Gold (Au) Body; Supplier 1: Digi-Key; Supplier Part Number 1: WM9458-ND; Supplier 2: Mouser; Supplier Part Number 2: 538-73251-1352; Supplier 3: Farnell; Supplier Part Number 3: *
Z1 = RHP-260+: High Pass Filter; Manufacturer: Mini-Circuits; Impedance: 50Ω; Name: RHP-260+; P/N: RHP-260+; Type: High Pass Filter; Package: GP731; Value: RHP-260+; Supplier 1: Digi-key; Supplier Part Number 1: 3157-RHP-260+CT-ND; Supplier 2: Mouser; Supplier Part Number 2: 139-RHP-260; Supplier 3: Farnell; Supplier Part Number 3: *
Z2 = SYD-20-33+: Directional Coupler; Manufacturer: Mini-Circuits; Impedance: 50Ω; Frequency: 30 to 3000 MHz; Name: SYD-20-33+; P/N: SYD-20-33+; Type: Directional Coupler; Package: AH202; Value: SYD-20-33+; Supplier 1: Digi-key; Supplier Part Number 1: 3157-SYD-20-33+CT-ND; Supplier 2: Mouser; Supplier Part Number 2: 139-SYD-20-33; Supplier 3: Farnell; Supplier Part Number 3: *

## Sheet Power.SchDoc: {Наименование}
size 420 x 297 mm; ApprovedBy: {Утвердил}; CheckedBy: {Проверил}; DrawnBy: {Разраб.}; DocumentNumber: НРДЦ.ХХХХХХ.ХХХ 00; SheetNumber: {}; SheetTotal: {}; Scale: {Мш.}; PageSetup: Record=PageOptions|CenterHorizontal=False|CenterVertical=False|PrintScale=0.95|XCorrection=0.00|YCorrection=0.00|PrintKind=1|BorderSize=5000000|LeftOffset=0|BottomOffset=0|Orientation=1|PaperLength=1000|PaperWidth=1000|Scale=100|PaperSource=15|PrintQuality=600|MediaType=1|DitherType=10|PaperKind=A4|PrintScaleMode=1; ProcessInspection: {Т.контр.}; Mass: {М.}; NormInspection: {Н.контр.}; Letter1Column: {}; Letter2Column: {}; Letter3Column: {}; DocumentType: {Документ}; Rule: PcbType=ProtelPcb
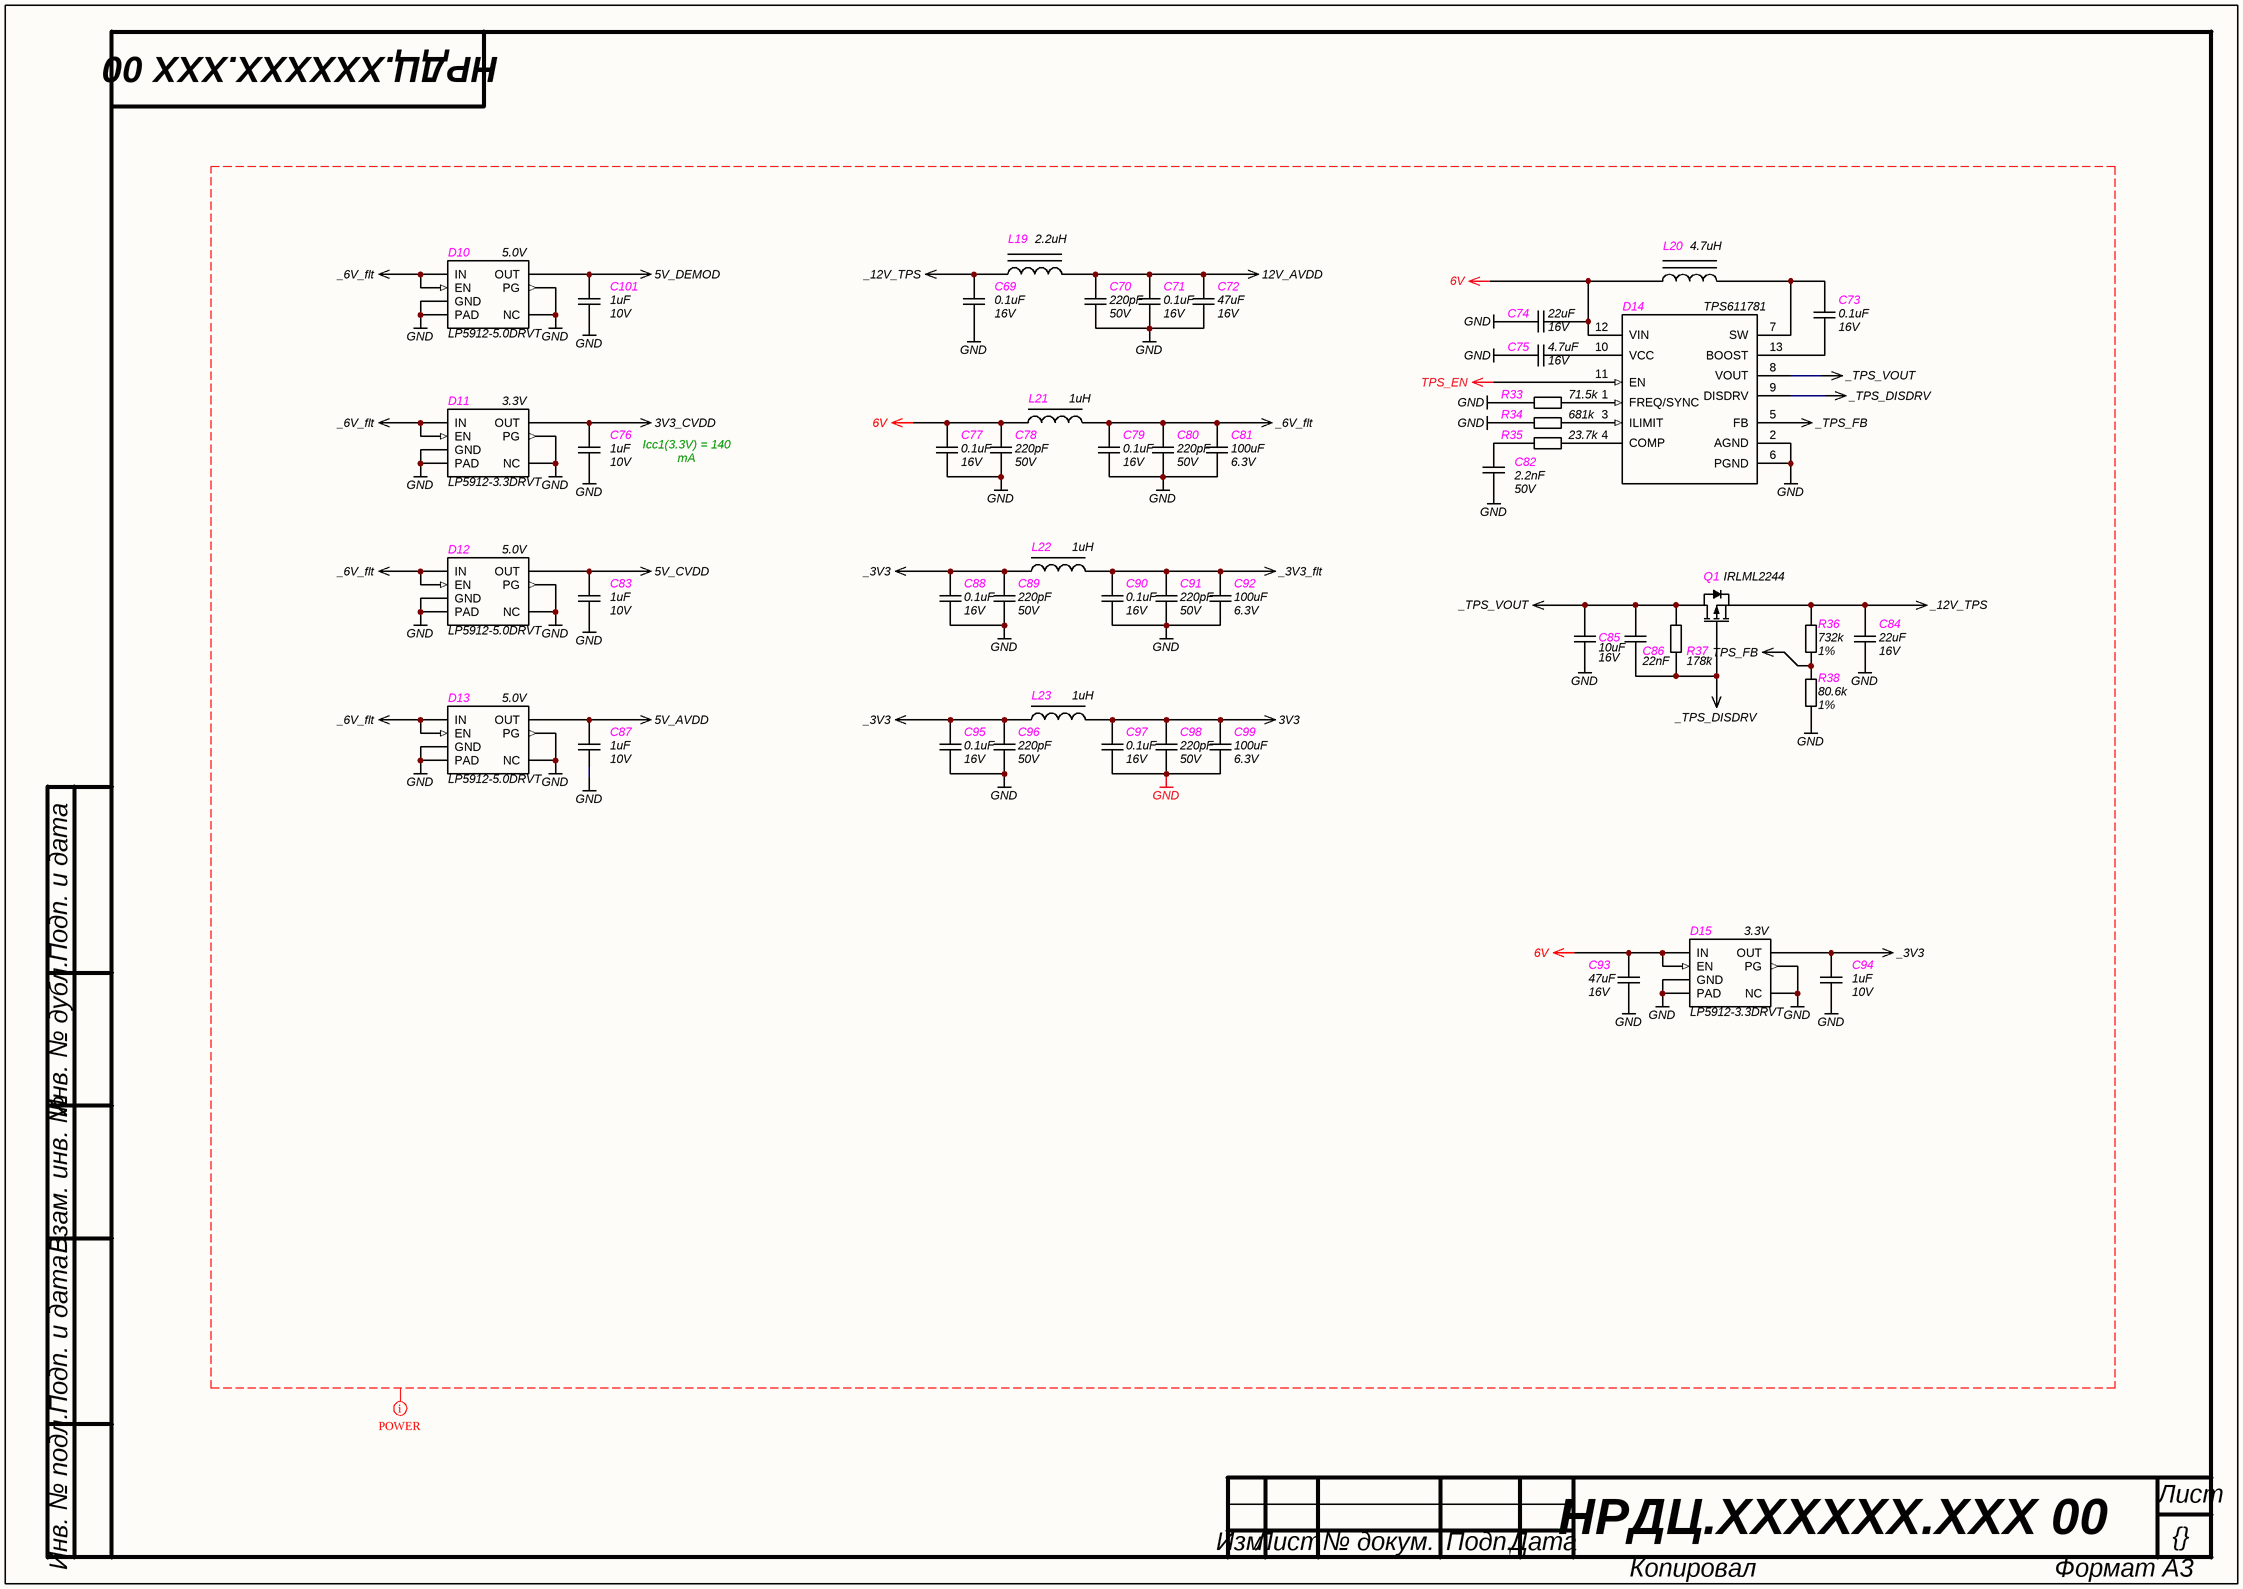
[diagram p2: Power.SchDoc]

### Parts
C69  value 0.1uF  Voltage: 16V  [C0402]  (hidden comment: CAP)
C70  value 220pF  Voltage: 50V  [C0603]  (hidden comment: CAP)
C71  value 0.1uF  Voltage: 16V  [C0402]  (hidden comment: CAP)
C72  value 47uF  Voltage: 16V  [C1210]  (hidden comment: CAP uF)
C73  value 0.1uF  Voltage: 16V  [C0402]  (hidden comment: CAP)
C74  value 22uF  Voltage: 16V  [C0805]  (hidden comment: CAP uF)
C75  value 4.7uF  Voltage: 16V  [C0603]  (hidden comment: CAP)
C76  value 1uF  Voltage: 10V  [C0805]  (hidden comment: CAP)
C77  value 0.1uF  Voltage: 16V  [C0402]  (hidden comment: CAP)
C78  value 220pF  Voltage: 50V  [C0603]  (hidden comment: CAP)
C79  value 0.1uF  Voltage: 16V  [C0402]  (hidden comment: CAP)
C80  value 220pF  Voltage: 50V  [C0603]  (hidden comment: CAP)
C81  value 100uF  Voltage: 6.3V  [C1210]  (hidden comment: CAP uF)
C82  value 2.2nF  Voltage: 50V  [C0603]  (hidden comment: CAP)
C83  value 1uF  Voltage: 10V  [C0805]  (hidden comment: CAP)
C84  value 22uF  Voltage: 16V  [C0805]  (hidden comment: CAP uF)
C85  value 10uF  Voltage: 16V  [C0805]  (hidden comment: CAP uF)
C86  value 22nF  [C0402]  (hidden comment: CAP)
C87  value 1uF  Voltage: 10V  [C0805]  (hidden comment: CAP)
C88  value 0.1uF  Voltage: 16V  [C0402]  (hidden comment: CAP)
C89  value 220pF  Voltage: 50V  [C0603]  (hidden comment: CAP)
C90  value 0.1uF  Voltage: 16V  [C0402]  (hidden comment: CAP)
C91  value 220pF  Voltage: 50V  [C0603]  (hidden comment: CAP)
C92  value 100uF  Voltage: 6.3V  [C1210]  (hidden comment: CAP uF)
C93  value 47uF  Voltage: 16V  [C1210]  (hidden comment: CAP uF)
C94  value 1uF  Voltage: 10V  [C0805]  (hidden comment: CAP)
C95  value 0.1uF  Voltage: 16V  [C0402]  (hidden comment: CAP)
C96  value 220pF  Voltage: 50V  [C0603]  (hidden comment: CAP)
C97  value 0.1uF  Voltage: 16V  [C0402]  (hidden comment: CAP)
C98  value 220pF  Voltage: 50V  [C0603]  (hidden comment: CAP)
C99  value 100uF  Voltage: 6.3V  [C1210]  (hidden comment: CAP uF)
C101  value 1uF  Voltage: 10V  [C0805]  (hidden comment: CAP)
D10  Name: LP5912-5.0DRVT  Voltage: 5.0V  [WSON-6]  (hidden comment: LP5912)
D11  Name: LP5912-3.3DRVT  Voltage: 3.3V  [WSON-6]  (hidden comment: LP5912)
D12  Name: LP5912-5.0DRVT  Voltage: 5.0V  [WSON-6]  (hidden comment: LP5912)
D13  Name: LP5912-5.0DRVT  Voltage: 5.0V  [WSON-6]  (hidden comment: LP5912)
D14  TPS611781  [TPS611781x]
D15  Name: LP5912-3.3DRVT  Voltage: 3.3V  [WSON-6]  (hidden comment: LP5912)
L19  value 2.2uH  [XAL4020]  (hidden comment: Inductor PWR)
L20  value 4.7uH  [XAL4030]  (hidden comment: Inductor PWR)
L21  value 1uH  [L1210_Murata LQH]  (hidden comment: Inductor LF)
L22  value 1uH  [L1210_Murata LQH]  (hidden comment: Inductor LF)
L23  value 1uH  [L1210_Murata LQH]  (hidden comment: Inductor LF)
Q1  IRLML2244  [SOT-23]
R33  value 71.5k  [R0402]  (hidden comment: RES)
R34  value 681k  [R0402]  (hidden comment: RES)
R35  value 23.7k  [R0603]  (hidden comment: RES)
R36  value 732k  Tolerance: 1%  [R0402]  (hidden comment: RES)
R37  value 178k  [R0402]  (hidden comment: RES)
R38  value 80.6k  Tolerance: 1%  [R0402]  (hidden comment: RES)

### Nets
3V3: C97.2 C98.2 C99.2 L23.2
3V3_CVDD: C76.1 D11.1(OUT)
5V_AVDD: C87.1 D13.1(OUT)
5V_CVDD: C83.1 D12.1(OUT)
5V_DEMOD: C101.1 D10.1(OUT)
6V: C74.1 C77.2 C78.2 C93.2 D14.12(VIN) D15.4(EN) D15.6(IN) L20.1 L21.1
12V_AVDD: C70.2 C71.2 C72.2 L19.2
_3V3: C88.2 C89.2 C94.1 C95.2 C96.2 D15.1(OUT) L22.1 L23.1
_3V3_flt: C90.2 C91.2 C92.2 L22.2
_6V_flt: C79.2 C80.2 C81.2 D10.4(EN) D10.6(IN) D11.4(EN) D11.6(IN) D12.4(EN) D12.6(IN) D13.4(EN) D13.6(IN) L21.2
_12V_TPS: C69.2 C84.2 L19.1 Q1.2(S) R36.2
_TPS_DISDRV: C86.2 D14.9(DISDRV) Q1.1(G) R37.1
_TPS_FB: D14.5(FB) R36.1 R38.2
_TPS_VOUT: C85.2 C86.1 D14.8(VOUT) Q1.3(D) R37.2
GND: C69.1 C70.1 C71.1 C72.1 C74.2 C75.2 C76.2 C77.1 C78.1 C79.1 C80.1 C81.1 C82.1 C83.2 C84.1 C85.1 C87.2 C88.1 C89.1 C90.1 C91.1 C92.1 C93.1 C94.2 C95.1 C96.1 C97.1 C98.1 C99.1 C101.2 D10.0(PAD) D10.2(NC) D10.3(PG) D10.5(GND) D11.0(PAD) D11.2(NC) D11.3(PG) D11.5(GND) D12.0(PAD) D12.2(NC) D12.3(PG) D12.5(GND) D13.0(PAD) D13.2(NC) D13.3(PG) D13.5(GND) D14.2(AGND) D14.6(PGND) D15.0(PAD) D15.2(NC) D15.3(PG) D15.5(GND) R33.1 R34.1 R38.1
TPS_EN: D14.11(EN)
NetC73_1: C73.1 D14.13(BOOST)
NetC73_2: C73.2 D14.7(SW) L20.2
NetC75_1: C75.1 D14.10(VCC)
NetC82_2: C82.2 R35.1
NetD14_1: D14.1(FREQ/SYNC) R33.2
NetD14_3: D14.3(ILIMIT) R34.2
NetD14_4: D14.4(COMP) R35.2

### Layout directives
net class POWER: 3V3, 3V3_CVDD, 5V_AVDD, 5V_CVDD, 5V_DEMOD, 6V, 12V_AVDD, _3V3, _3V3_flt, _6V_flt, _12V_TPS, _TPS_DISDRV, _TPS_FB, _TPS_VOUT, GND, TPS_EN

### Notes on the sheet
- (near C76) Icc1(3.3V) = 140 mA
  Icc2(3.3V) = 130 mA
- Подп. и дата
- Инв. № дубл.
- Взам. инв. №
- Инв. № подл.
- Лист
- Изм.
- № докум.
- Подп.
- Дата
- Копировал
- Формат А3

### Library data of the parts
C69 C71 C73 C77 C79 C88 C90 C95 C97 = CAP: SMD Capacitor; Manufacturer: Murata; Material: X7R; Tolerance: 10%; Type: Ceramic Capacitor; P/N: GRM155R71C104KA88J; Supplier 1: Digi-key; Supplier Part Number 1: 490-6328-1-ND; Supplier 2: Mouser; Supplier Part Number 2: 81-GRM155R71C104KA8J; Supplier 3: Farnell; Supplier Part Number 3: *
C70 C78 C80 C89 C91 C96 C98 = CAP: SMD Capacitor; Manufacturer: KEMET; Material: X7R; Tolerance: 10%; Type: Ceramic Capacitor; P/N: C0603C221K5RACAUTO; Supplier 1: Digi-key; Supplier Part Number 1: 399-6869-1-ND; Supplier 2: Mouser; Supplier Part Number 2: 80-C0603C221K5RAUTO; Supplier 3: Farnell; Supplier Part Number 3: *
C72 C93 = CAP uF: SMD Capacitor; Manufacturer: Murata; Material: X6S; Tolerance: 10%; Type: Ceramic Capacitor; P/N: GRM32EC81C476KE15L; Supplier Part Number 1: 490-10531-1-ND; Supplier 2: Mouser; Supplier Part Number 2: 81-GRM32EC81C476KE5L; Supplier 3: Farnell; Supplier Part Number 3: *
  C72: Supplier 1: Digi-Key
  C93: Supplier 1: Digi-key
C74 C84 = CAP uF: SMD Capacitor; Manufacturer: Murata; Material: X5R; Tolerance: ±20%; Type: Ceramic Capacitor; P/N: GRM21BR61C226ME44L; Supplier Part Number 1: 490-10747-1-ND; Supplier 2: Mouser; Supplier Part Number 2: 81-GRM21BR61C226ME4L; Supplier 3: Farnell; Supplier Part Number 3: *
  C74: Supplier 1: Digi-Key
  C84: Supplier 1: Digi-key
C75 = CAP: SMD Capacitor; Manufacturer: Murata; Material: X5R; Tolerance: 10%; Type: Ceramic Capacitor; P/N: GRM188R61C475KAAJD; Supplier 1: Digi-key; Supplier Part Number 1: 490-10481-1-ND; Supplier 2: Mouser; Supplier Part Number 2: 81-GRM188R61C475KAJD; Supplier 3: Farnell; Supplier Part Number 3: *
C76 C83 C87 C94 C101 = CAP: SMD Capacitor; Manufacturer: Murata; Material: X7R; Tolerance: 10%; Type: Ceramic Capacitor; P/N: GRM21BR71A105KA01K; Supplier 1: Digi-key; Supplier Part Number 1: 490-11595-1-ND; Supplier 2: Mouser; Supplier Part Number 2: 81-GRM40X105K10K; Supplier 3: Farnell; Supplier Part Number 3: *
C81 C92 C99 = CAP uF: SMD Capacitor; Manufacturer: Murata; Material: X5R; Tolerance: 20%; Type: Ceramic Capacitor; P/N: GRM32ER60J107ME20L; Supplier 1: Digi-key; Supplier Part Number 1: 490-3390-1-ND; Supplier 2: Mouser; Supplier Part Number 2: 81-GRM32ER60J107ME20; Supplier 3: Farnell; Supplier Part Number 3: *
C82 = CAP: SMD Capacitor; Manufacturer: Murata; Material: NP0; Tolerance: ±5%; Type: Ceramic Capacitor; P/N: GRM1885C1H222JA01D; Supplier 1: Digi-key; Supplier Part Number 1: 490-1459-1-ND; Supplier 2: Mouser; Supplier Part Number 2: 81-GRM1885C1H222JA01; Supplier 3: Farnell; Supplier Part Number 3: *
C85 = CAP uF: SMD Capacitor; Manufacturer: Murata; Material: X5R; Tolerance: ±10%; Type: Ceramic Capacitor; P/N: GRM21BR61C106KE15K; Supplier 1: Digi-key; Supplier Part Number 1: 490-6473-1-ND; Supplier 2: Mouser; Supplier Part Number 2: 81-GRM21BR61C106KE5K; Supplier 3: Farnell; Supplier Part Number 3: *
C86 = CAP: SMD Capacitor; Manufacturer: Murata; Material: X7R; Tolerance: 10%; Voltage: 50V; Type: Ceramic Capacitor; P/N: GCM155R71H223KA55D; Supplier 1: Digi-key; Supplier Part Number 1: 490-4763-1-ND; Supplier 2: Mouser; Supplier Part Number 2: 81-GCM155R71H223KA5D; Supplier 3: Farnell; Supplier Part Number 3: *
D10-D13 D15 = LP5912: LP5912 500-mA Low-Noise, Low-IQ LDO; Manufacturer: Texas Instruments; Type: Low-Noise LDO; Current: 500mA; Package: WSON; Temperature Range: –40°C to 125°C; Supplier 1: Digi-key; Supplier 2: Mouser; Supplier 3: Farnell; Supplier Part Number 3: *
  D10 D12 D13: P/N: LP5912-5.0DRVT; Supplier 4: Arrow Electronics; Supplier Part Number 4: LP5912-5.0DRVT; Supplier Part Number 1: 296-52224-1-ND; Supplier Part Number 2: 595-LP5912-5.0DRVT
  D11 D15: P/N: LP5912-3.3DRVT; Supplier Part Number 1: 296-44153-2-ND; Supplier Part Number 2: 595-LP5912-3.3DRVT
D14 = TPS611781: 10-A Fully-Integrated Synchronous Boost with Load Disconnect Control; Manufacturer: Texas Instruments; Voltage: 4.5 V to 20 V; P/N: TPS611781RNW; Current: 10 A; Name: TPS611781; Package: 13-VQFN-HR (3.5x3.0); Temperature Range: –40°C to 125°C; Type: Synchronous Boost; Supplier 1: Digi-Key; Supplier Part Number 1: 296-46568-1-ND; Supplier 2: Mouser; Supplier Part Number 2: 595-TPS611781RNWT; Supplier 3: Farnell; Supplier Part Number 3: *
L19 = Inductor PWR: Magnetic-Core Inductor; Manufacturer: Coilcraft; Name: XEL4020-222MEC; Current: 5.9A; Tolerance: ±30%; Temperature Range: -40ºC to 125ºC; P/N: XEL4020-222MEC; Supplier 2: Mouser; Supplier Part Number 2: 994-XEL4020-222MEC; Supplier 3: Farnell; Supplier Part Number 3: 2836818; Supplier 1: Digi-key; Supplier Part Number 1: *
L20 = Inductor PWR: Magnetic-Core Inductor; Manufacturer: Coilcraft; Name: XEL4030-472MEC; Current: 5A; Tolerance: ±30%; Temperature Range: -40ºC to 125ºC; P/N: XEL4030-472MEC; Supplier 1: Digi-key; Supplier Part Number 1: *; Supplier 2: Mouser; Supplier Part Number 2: 994-XEL4030-472MEC; Supplier 3: Farnell; Supplier Part Number 3: 2836831
L21-L23 = Inductor LF: Inductor Power Lines; Manufacturer: Murata; Name: LQH32PN1R0NNC; Current: 2500mA; Tolerance: 5%; Frequency: 100MHz; Temperature Range: -25ºC to 85ºC; Series: LQH; P/N: LQH32PN1R0NNC; Supplier 1: Digi-key; Supplier Part Number 1: 490-12035-1-ND; Supplier 2: Mouser; Supplier Part Number 2: 81-LQH32PN1R0NNCL; Supplier 3: Farnell; Supplier Part Number 3: *
Q1 = IRLML2244: P-Channel MOSFET; Current: 4.3A; Channel Resistance: 54 mΩ; Power Dissipation: 1.3W; Voltage: -20V; P/N: IRLML2244TRPBF; Name: IRLML2244; Package: SOT-23; Type: P-Channel Mosfet; Value: IRLML2244; Supplier 1: Digi-key; Supplier Part Number 1: IRLML2244TRPBFCT-ND; Supplier 2: Mouser; Supplier Part Number 2: 942-IRLML2244TRPBF; Supplier 3: Farnell; Supplier Part Number 3: 2468051
R33 = RES: SMD Resistor; Manufacturer: Panasonic Electronic Components; Name: Chip SMD Resistor; Power: 0.063 Wt; Tolerance: 1%; P/N: ERJ-2RKF7152X; Temperature Range: -55…155°C; Supplier 1: Digi-key; Supplier Part Number 1: P71.5KLCT-ND; Supplier 2: Mouser; Supplier Part Number 2: 667-ERJ-2RKF7152X; Supplier 3: Farnell; Supplier Part Number 3: *
R34 = RES: SMD Resistor; Manufacturer: Panasonic Electronic Components; Name: Chip SMD Resistor; Power: 0.063 Wt; Tolerance: 1%; P/N: ERJ-2RKF6813X; Temperature Range: -55…155°C; Supplier 1: Digi-key; Supplier Part Number 1: P681KLCT-ND; Supplier 2: Mouser; Supplier Part Number 2: 667-ERJ-2RKF6813X; Supplier 3: Farnell; Supplier Part Number 3: *
R35 = RES: SMD Resistor; Manufacturer: Panasonic Electronic Components; Name: Chip SMD Resistor; Power: 0.1 Wt; Tolerance: 1%; P/N: ERJ-3EKF2372V; Temperature Range: -55…155°C; Supplier 1: Digi-key; Supplier Part Number 1: P23.7KHCT-ND; Supplier 2: Mouser; Supplier Part Number 2: 667-ERJ-3EKF2372V; Supplier 3: Farnell; Supplier Part Number 3: *
R36 = RES: SMD Resistor; Manufacturer: Panasonic Electronic Components; Name: Chip SMD Resistor; Power: 0.063 Wt; P/N: ERJ-2RKF7323X; Temperature Range: -55…155°C; Supplier 1: Digi-key; Supplier Part Number 1: P732KLCT-ND; Supplier 2: Mouser; Supplier Part Number 2: 667-ERJ-2RKF7323X; Supplier 3: Farnell; Supplier Part Number 3: *
R37 = RES: SMD Resistor; Manufacturer: Panasonic Electronic Components; Name: Chip SMD Resistor; Power: 0.063 Wt; Tolerance: 1%; P/N: ERJ-2RKF1783X; Temperature Range: -55…155°C; Supplier 1: Digi-key; Supplier Part Number 1: P178KLCT-ND; Supplier 2: Mouser; Supplier Part Number 2: 667-ERJ-2RKF1783X; Supplier 3: Farnell; Supplier Part Number 3: *
R38 = RES: SMD Resistor; Manufacturer: Panasonic Electronic Components; Name: Chip SMD Resistor; Power: 0.063 Wt; P/N: ERJ-2RKF8062X; Temperature Range: -55…155°C; Supplier 1: Digi-key; Supplier Part Number 1: P80.6KLCT-ND; Supplier 2: Mouser; Supplier Part Number 2: 667-ERJ-2RKF8062X; Supplier 3: Farnell; Supplier Part Number 3: *